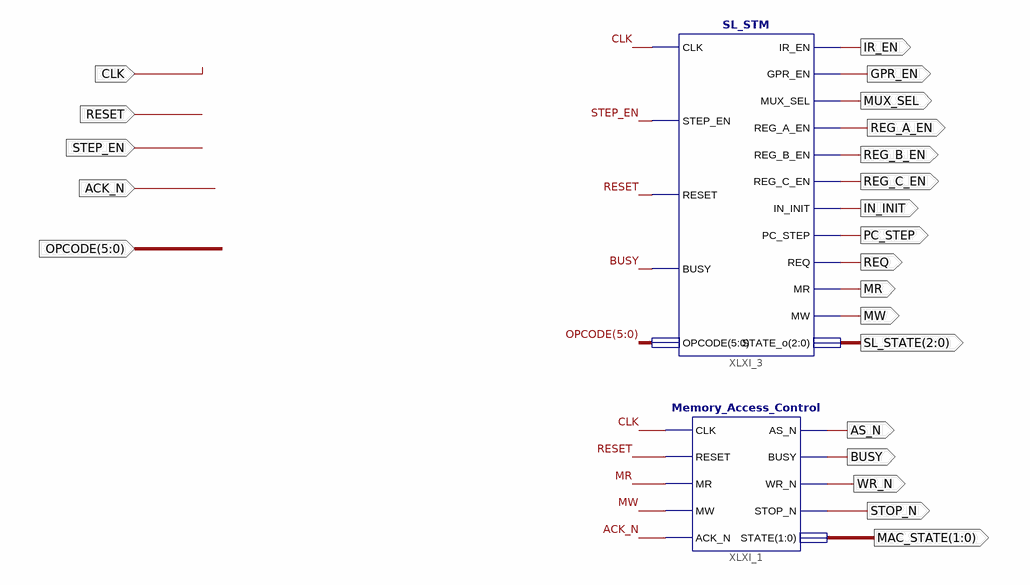
[diagram p0: schematic sheet 1]
// Xilinx ISE schematic Control6_top.sch (spartan6) as structural Verilog: 2 symbols, 22 ports
module Control6_top (
  input  CLK,
  input  RESET,
  input  STEP_EN,
  input  ACK_N,
  input  [5:0] OPCODE,
  output BUSY,
  output IR_EN,
  output GPR_EN,
  output MUX_SEL,
  output REG_A_EN,
  output REG_B_EN,
  output REG_C_EN,
  output IN_INIT,
  output PC_STEP,
  output REQ,
  output MW,
  output [2:0] SL_STATE,
  output MR,
  output AS_N,
  output WR_N,
  output STOP_N,
  output [1:0] MAC_STATE
);

  SL_STM XLXI_3 (
    .CLK(CLK), .STEP_EN(STEP_EN), .RESET(RESET), .BUSY(BUSY), .OPCODE(OPCODE), .IR_EN(IR_EN),
    .GPR_EN(GPR_EN), .MUX_SEL(MUX_SEL), .REG_A_EN(REG_A_EN), .REG_B_EN(REG_B_EN), .REG_C_EN(REG_C_EN),
    .IN_INIT(IN_INIT), .PC_STEP(PC_STEP), .REQ(REQ), .MR(MR), .MW(MW), .STATE_o(SL_STATE));
  Memory_Access_Control XLXI_1 (
    .CLK(CLK), .RESET(RESET), .MR(MR), .MW(MW), .ACK_N(ACK_N), .AS_N(AS_N), .BUSY(BUSY), .WR_N(WR_N),
    .STOP_N(STOP_N), .STATE(MAC_STATE));
endmodule
